# EasyEDA Pro project 数控UPS.epro, board PCB2_1
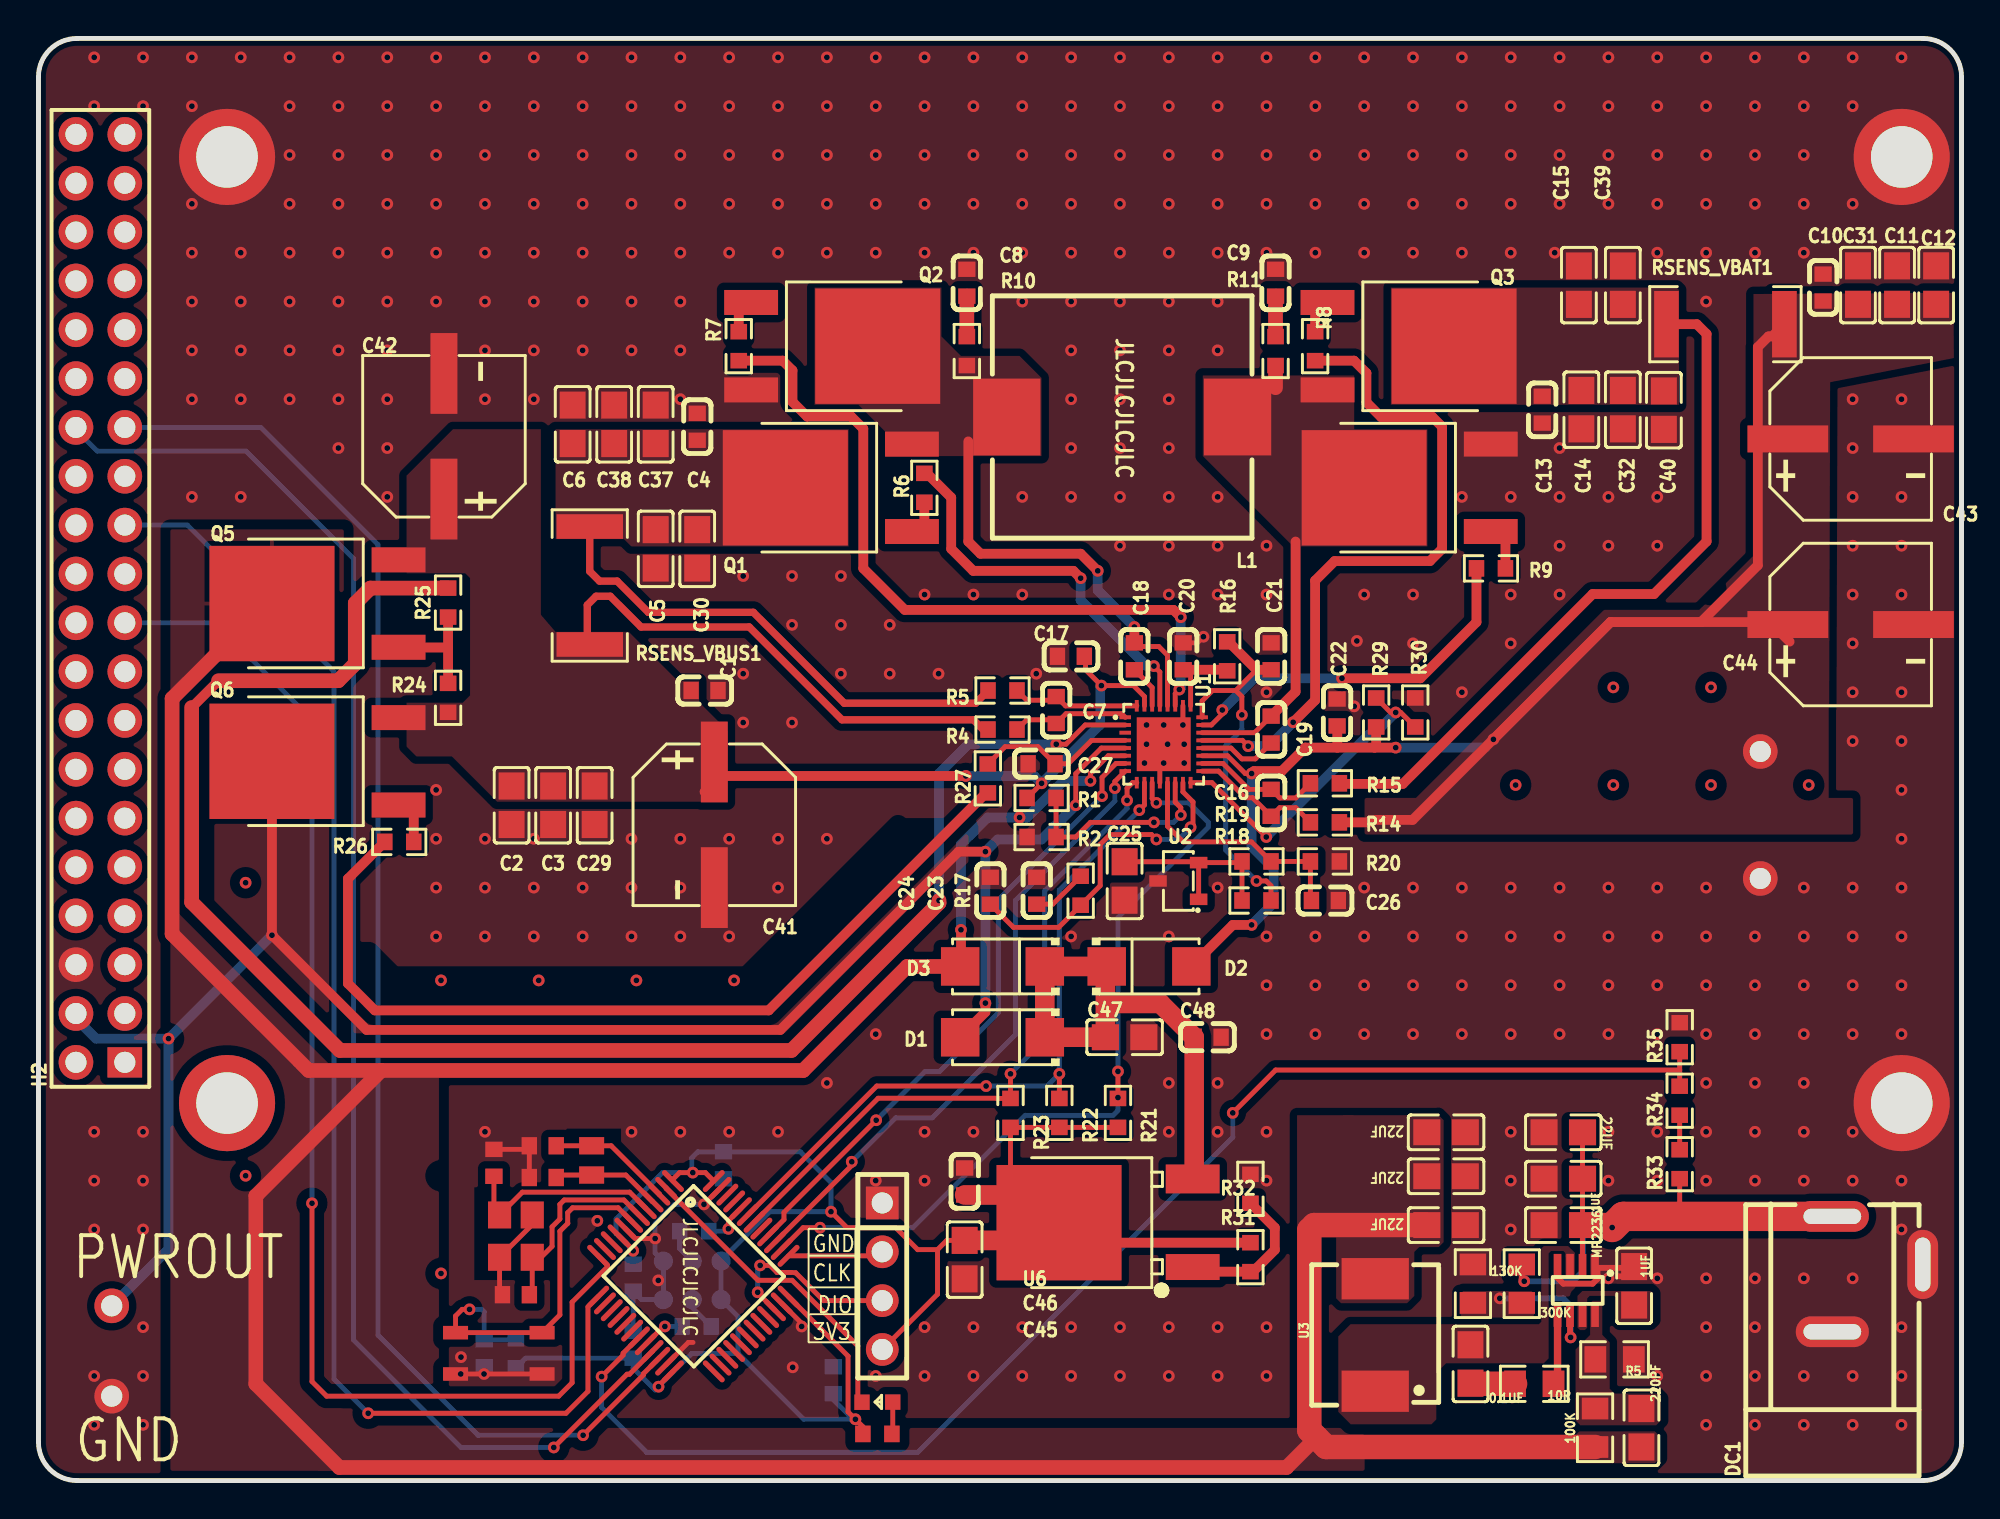
[diagram p7: board, top side]
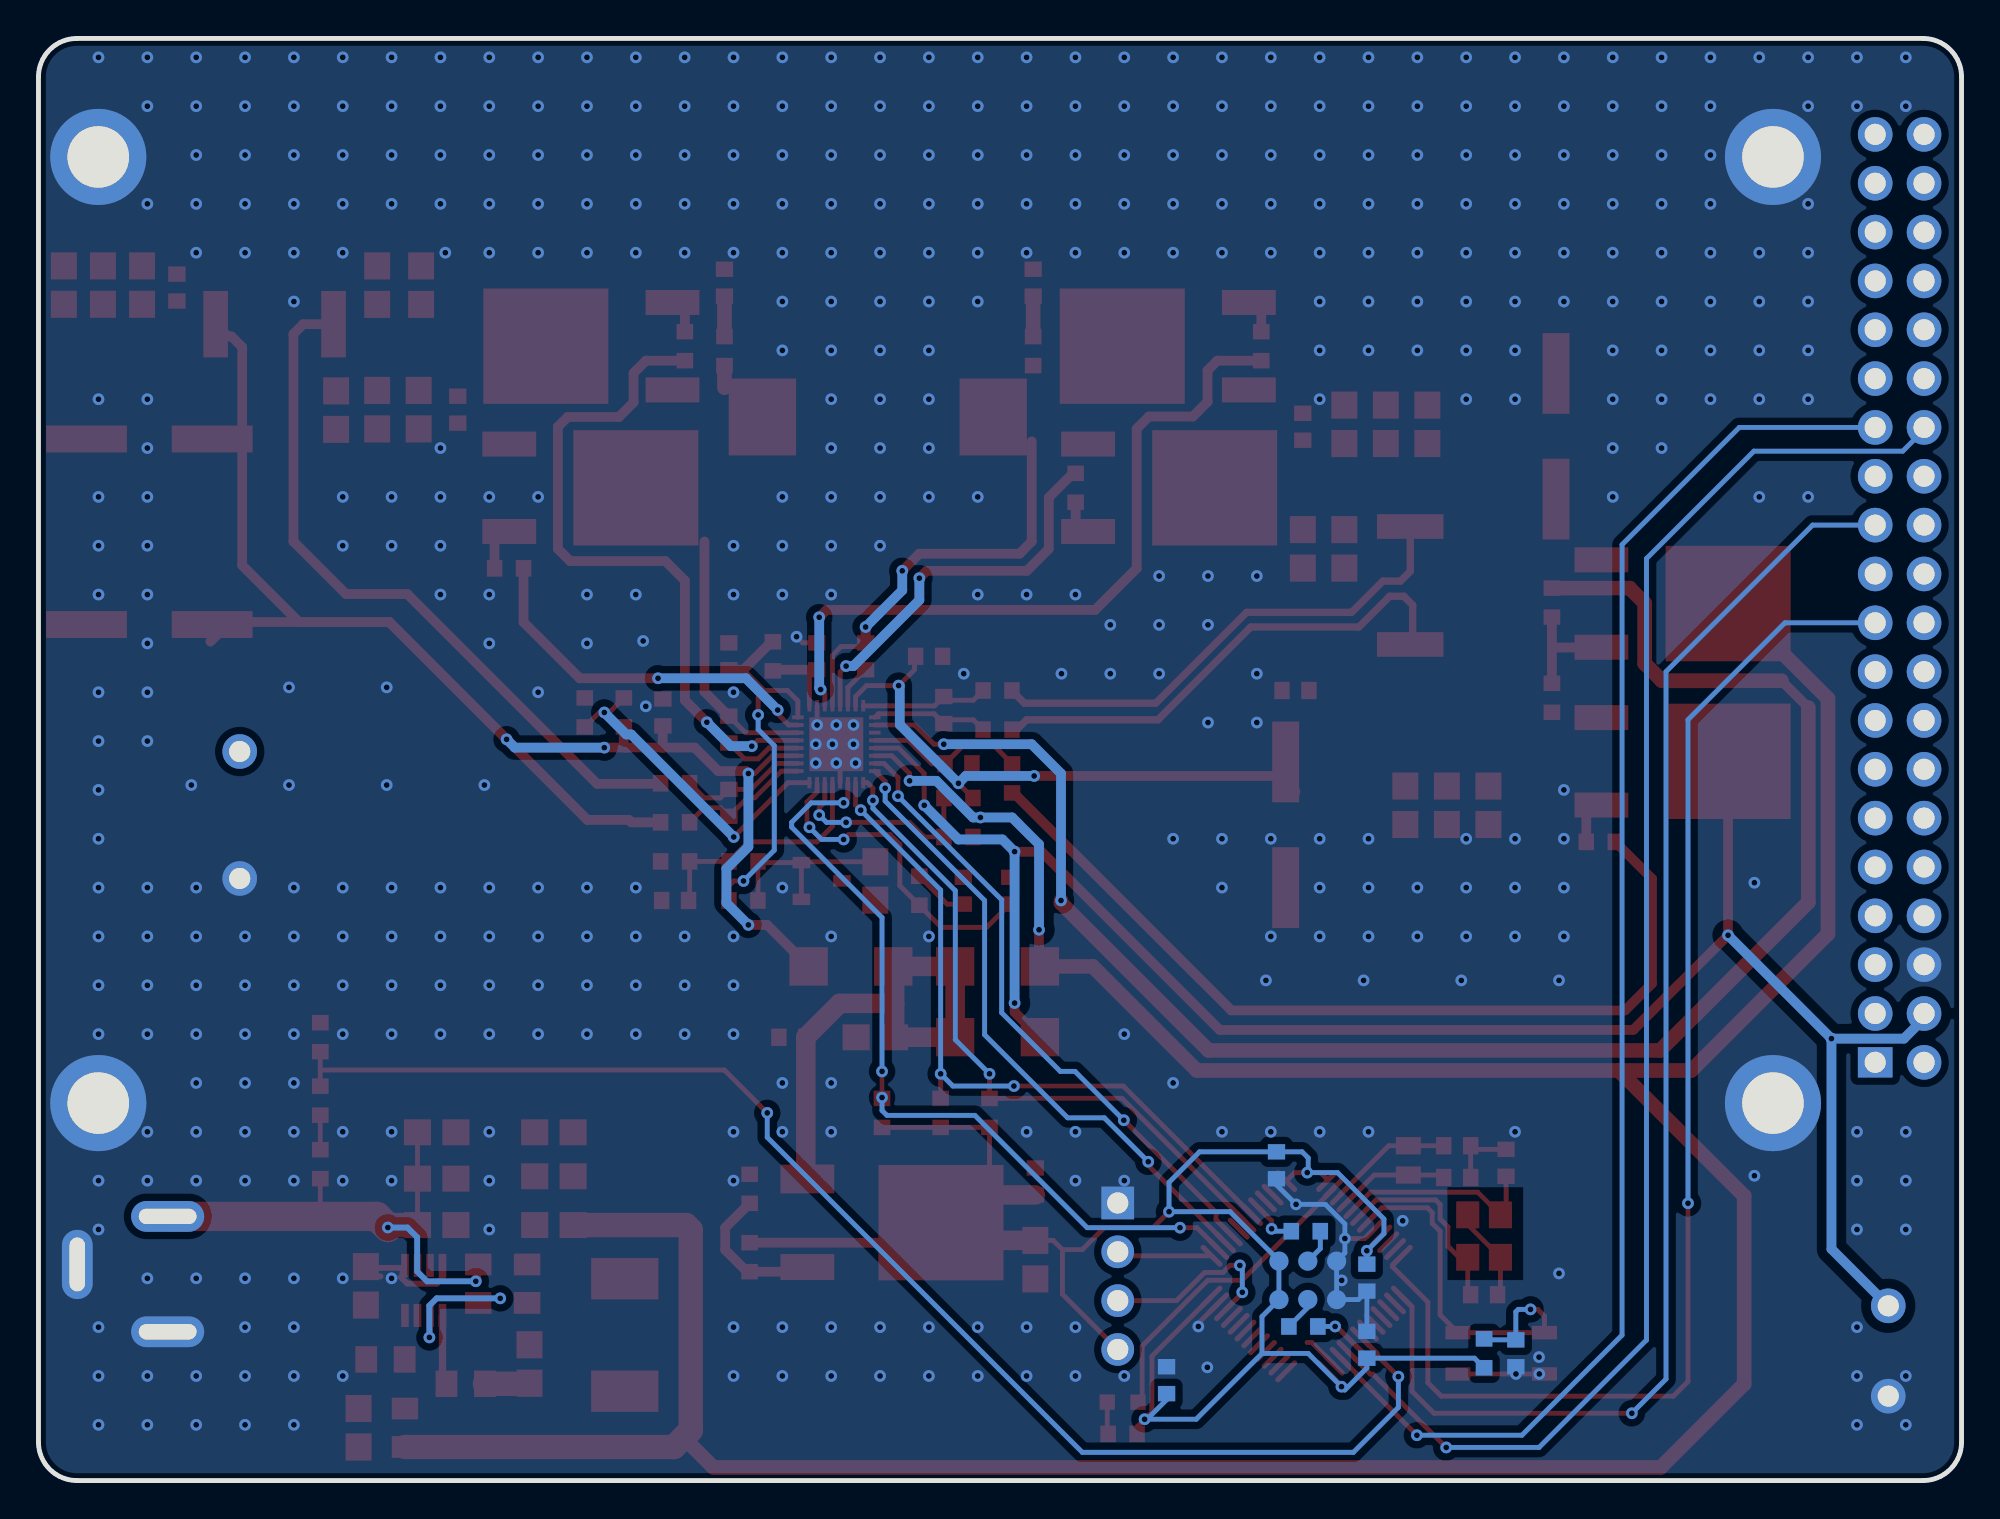
[diagram p8: board, bottom side, seen from below]

Outline 100 x 75 mm; copper layers: Top Layer, Bottom Layer. Coordinates in mm from the lower left corner of the outline.
Outline path: 0,73 0,2 arc(0.59,0.59) 2,0 98,0 arc(99.41,0.59) 100,2 100,73 arc(99.41,74.41) 98,75 2,75 arc(0.59,74.41) 0,73
Stack: Top Layer 0.035mm / Dielectric1 1.51mm FR4 er 4.5 / Bottom Layer 0.035mm

## Design rules (mm)
spacing safeClearance (default): track to track 0.152, other pairs 0.152 to 0.3
track width trackWidth (default): min 0.127, default 0.254, max 2.54
differential pair differentialPair (default): width min 0.127, default 0.254, max 2.54; gap min 0.152, default 0.152
via viaSize (default): diameter min 0.5, default 0.61, max 10; hole min 0.3, default 0.305, max 6
spacing safeClearance (default): track to track 0.152, other pairs 0.152 to 0.3
track width trackWidth (default): min 0.127, default 0.254, max 2.54
differential pair differentialPair (default): width min 0.127, default 0.254, max 2.54; gap min 0.152, default 0.152
via viaSize (default): diameter min 0.5, default 0.61, max 10; hole min 0.3, default 0.305, max 6
spacing safeClearance (default): track to track 0.152, other pairs 0.152 to 0.3
track width trackWidth (default): min 0.127, default 0.254, max 2.54
differential pair differentialPair (default): width min 0.127, default 0.254, max 2.54; gap min 0.152, default 0.152
via viaSize (default): diameter min 0.5, default 0.61, max 10; hole min 0.3, default 0.305, max 6
template: 自定义配置
spacing copperThickness1oz (default): track to track 0.102, other pairs 0.152 to 0.3
spacing copperThickness2oz: track to track 0.203, other pairs 0.152 to 0.3
track width copperThickness1oz: min 0.127, default 0.254, max 2.54
track width copperThickness2oz (default): min 0.203, default 0.254, max 98.999
differential pair differentialPair (default): width min 0.127, default 0.254, max 2.54; gap min 0.152, default 0.152
via viaSize (default): diameter min 0.5, default 0.61, max 10; hole min 0.3, default 0.305, max 6.299
net PWROUT uses copperRegion1
net PWRIN uses copperRegion1
net GND uses PWRGND
pour e4570 uses copperRegion1
pour e4675 uses copperRegion1
pour e5215 uses PWRGND

## Placement (name value [footprint] x y rotation side)
0.1UF  -  [C0805]  74.47 6.06 270 top
1UF  -  [C0805]  82.97 10.13 270 top
1UF#2  -  [C0805]  79.29 13.29 0 top
8M  -  [CRYSTAL-SMD_4P-L3.2-W2.5-BL]  24.83 12.71 270 top
10R  -  [R0805]  77.78 5.03 180 top
100K  -  [R0805]  80.94 2.75 270 top
130K  -  [R0805]  74.59 10.24 270 top
220PF  -  [C0805]  83.35 2.75 270 top
300K  -  [R0805]  77.13 10.24 90 top
C1  100nF  [C0603]  34.64 41.09 180 top
C1#2  -  [C0805]  79.29 18.11 0 top
C2  2.2uF  [C0805]  24.6 35.12 90 top
C2#2  -  [C0805]  79.29 15.7 0 top
C3  10uF  [C0805]  26.76 35.12 90 top
C4  100nF  [C0603]  34.25 54.81 270 top
C5  2.2uF  [C0805]  32.1 48.45 90 top
C5#2  -  [C0603]  30.92 10.55 270 bottom
C6  10uF  [C0805]  27.78 54.93 270 top
C6#2  -  [C0805]  73.19 13.29 180 top
C6#3  -  [C0603]  30.92 7.06 270 bottom
C7  22nF  [C0603]  52.92 40.07 90 top
C7#2  -  [C0805]  73.19 15.83 180 top
C7#3  -  [C0603]  41.34 5.22 90 bottom
C8  1nF  [C0603]  48.28 62.3 90 top
C8#2  -  [C0805]  73.19 18.11 180 top
C8#3  -  [C0603]  35.62 16.4 270 bottom
C9  1nF  [C0603]  64.33 62.3 90 top
C9#2  -  [C0603]  23.18 6.62 90 bottom
C10  100nF  [C0603]  92.8 62.04 270 top
C10#2  -  [C0603]  26.22 17.41 180 top
C11  2.2uF  [C0805]  96.65 62.17 270 top
C11#2  -  [C0603]  26.22 15.76 180 top
C12  10uF  [C0805]  98.68 62.17 270 top
C12#2  -  [C0603]  23.68 16.52 90 top
C13  100nF  [C0603]  78.2 55.69 90 top
C13#2  -  [C0603]  24.83 9.66 0 top
C14  2.2uF  [C0805]  80.23 55.69 90 top
C15  10uF  [C0805]  80.1 62.17 270 top
C16  22nF  [C0603]  64.1 35.25 90 top
C17  1uF  [C0603]  53.69 42.87 180 top
C18  100nF  [C0603]  56.99 42.87 90 top
C19  100nF  [C0603]  64.1 39.06 270 top
C20  1uF  [C0603]  59.53 42.87 90 top
C21  1uF  [C0603]  64.1 42.87 90 top
C22  1uF  [C0603]  67.53 39.95 90 top
C23  22nF  [C0603]  51.91 30.67 270 top
C24  NC  [C0603]  49.5 30.67 270 top
C25  10uF  [C0805]  56.48 31.18 90 top
C26  100nF  [C0603]  66.89 30.17 180 top
C27  NC  [C0603]  52.16 37.28 0 top
C29  10uF  [C0805]  28.92 35.12 90 top
C30  10uF  [C0805]  34.25 48.45 90 top
C31  10uF  [C0805]  94.62 62.17 270 top
C32  10uF  [C0805]  82.39 55.69 90 top
C37  10uF  [C0805]  32.1 54.93 270 top
C38  10uF  [C0805]  29.94 54.93 270 top
C39  10uF  [C0805]  82.39 62.17 270 top
C40  10uF  [C0805]  84.52 55.67 90 top
C41  220uF  [CAP-SMD_BD8.0-L8.3-W8.3-FD]  35.14 34.1 270 top
C42  220uF  [CAP-SMD_BD8.0-L8.3-W8.3-FD]  21.08 54.31 90 top
C43  220uF  [CAP-SMD_BD8.0-L8.3-W8.3-FD]  94.23 54.17 0 top
C44  220uF  [CAP-SMD_BD8.0-L8.3-W8.3-FD]  94.23 44.52 0 top
C45  10uF  [C0805]  48.16 11.49 90 top
C46  100nF  [C0603]  48.16 15.55 270 top
C47  10uF  [C0805]  56.48 23.06 0 top
C48  100nF  [C0603]  60.8 23.06 0 top
D1  SS34  [SMA_L4.3-W2.6-LS5.2-RD]  50.13 23.06 180 top
D2  SS34  [SMA_L4.3-W2.6-LS5.2-RD]  57.75 26.74 0 top
D3  SS34  [SMA_L4.3-W2.6-LS5.2-RD]  50.13 26.74 180 top
DC1  DC-005-5.5*2.1  [DC-IN-TH_DC-005-2]  95.63 10.74 90 top
H1  -  [HDR-TH_4P-P2.54-V-M]  43.88 10.63 270 top
H2  B-2100S40P-B110  [HDR-TH_40P-P2.54-V-M-R2-C20-S2.54]  3.22 45.88 90 top
L1  3.3uH  [IND-SMD_L13.5-W12.6]  56.35 55.31 0 top
LED2  -  [LED0603-RD]  43.62 4.08 0 top
MP2236  -  [MP2236]  80.94 8.59 180 top
NOREF  -  [Pad_e7509]  3.81 4.39 0 top
NOREF#2  -  [Pad_e152]  9.81 19.63 0 top
NOREF#3  -  [Pad_e4203]  3.81 9.09 0 top
NOREF#4  -  [Pad_e7513]  89.53 37.92 0 top
NOREF#5  -  [Pad_e150]  96.89 19.63 0 top
NOREF#6  -  [Pad_e148]  96.89 68.84 0 top
NOREF#7  -  [Pad_e7515]  89.53 31.31 0 top
NOREF#8  -  [Pad_e155]  9.81 68.84 0 top
Q1  NCE4060K  [TO-252-2_L6.6-W6.1-P4.57-LS9.9-TL-CW]  42.13 51.63 180 top
Q2  NCE4060K  [TO-252-2_L6.6-W6.1-P4.57-LS9.9-TL-CW]  40.35 59 0 top
Q3  NCE4060K  [TO-252-2_L6.6-W6.1-P4.57-LS9.9-TL-CW]  70.32 59 0 top
Q4  NCE4060K  [TO-252-2_L6.6-W6.1-P4.57-LS9.9-TL-CW]  72.23 51.63 180 top
Q5  NCE60P50K  [TO-252-2_L6.6-W6.1-P4.57-LS9.9-TL-CW]  15.43 45.61 180 top
Q6  NCE60P50K  [TO-252-2_L6.6-W6.1-P4.57-LS9.9-TL-CW]  15.43 37.41 180 top
R1  10K  [R0603]  52.16 35.5 180 top
R2  10K  [R0603]  52.16 33.47 0 top
R2#2  -  [R0603]  34.23 8.01 0 bottom
R3  10R  [R0603]  34.1 12.97 0 bottom
R4  2Ω  [R0603]  50.13 39.06 180 top
R4#2  -  [R0603]  24.83 6.62 270 bottom
R5  2Ω  [R0805]  81.96 6.3 180 top
R5#2  -  [R0603]  50.13 41.09 180 top
R5#3  -  [R0603]  43.62 2.43 0 top
R6  1Ω  [R0603]  46.07 51.63 270 top
R7  1Ω  [R0603]  36.41 59 90 top
R8  1Ω  [R0603]  66.39 59 270 top
R9  1Ω  [R0603]  75.53 47.44 180 top
R10  2.2Ω  [R0603]  48.28 58.74 90 top
R11  2.2Ω  [R0603]  64.33 58.74 90 top
R14  2Ω  [R0603]  66.89 34.23 0 top
R15  2Ω  [R0603]  66.89 36.26 0 top
R16  0Ω  [R0603]  61.81 42.87 90 top
R17  10k  [R0603]  54.19 30.67 270 top
R18  1k  [R0603]  63.34 30.17 0 top
R19  10K  [R0603]  63.34 32.2 180 top
R20  10K  [R0603]  66.89 32.2 180 top
R21  10k  [R0603]  56.13 19.12 90 top
R22  4.7kΩ  [R0603]  53.09 19.12 90 top
R23  4.7kΩ  [R0603]  50.55 19.12 90 top
R24  10K  [R0603]  21.3 40.71 270 top
R25  0Ω  [R0603]  21.3 45.66 270 top
R26  0Ω  [R0603]  18.76 33.22 0 top
R27  0Ω  [R0603]  49.37 36.52 90 top
R29  0Ω  [R0603]  69.56 39.95 270 top
R30  NC  [R0603]  71.59 39.95 270 top
R31  200Ω  [R0603]  63.02 11.62 270 top
R32  330Ω  [R0603]  63.02 15.17 90 top
R33  300K  [R0603]  85.34 16.45 90 top
R34  130K  [R0603]  85.34 19.75 90 top
R35  100K  [R0603]  85.34 23.06 90 top
RSENS_VBAT1  10mΩ  [R2512]  87.72 60.14 0 top
RSENS_VBUS1  10mΩ  [R2512]  28.67 46.55 90 top
STM32F103C8T6  -  [LQFP-48_L7.0-W7.0-P0.50-LS9.0-BL]  34.05 10.63 225 top
SW1  -  [SW-SMD_4P-L4.2-W3.3-P2.15-LS5.1]  23.94 6.62 0 top
U1  SC8815QDER  [QFN-32_L4.0-W4.0-P0.40-BL-EP2.7]  58.51 38.3 270 top
U1#2  -  [焊点3*2]  35.5 9.41 90 bottom
U2  TL431  [SOT-23-3_L2.9-W1.4-P1.90-LS2.6-BR]  59.27 31.18 0 top
U3  3.3uh  [IND-SMD_L6.8-W6.8_SMMS0630]  69.51 7.57 90 top
U6  LM317AG-TN3-R  [TO-252-2_L6.5-W6.1-P4.58-LS10.0-TL]  56.54 13.39 180 top
X1  -  [CRYSTAL-SMD_L2.0-W1.2]  28.76 16.65 90 top

## Footprints (pads in the part's own frame, mm; a bottom-side part is the same pattern mirrored in y, then rotated)
C0603
  rect 0.8x0.9 smd: 1(-0.7,0) 2(0.7,0)
C0805
  rect 1.41x1.35 smd: 1(-1,0) 2(1,0)
CAP-SMD_BD8.0-L8.3-W8.3-FD
  rect 4.2x1.4 smd: 1(-3.267,0) 2(3.267,0)
CRYSTAL-SMD_4P-L3.2-W2.5-BL
  rect 1.4x1.2 smd: 1(-1.1,-0.85) 2(1.1,-0.85) 3(1.1,0.85) 4(-1.1,0.85)
CRYSTAL-SMD_L2.0-W1.2
  rect 0.899x1.3 smd: 1(-0.762,0) 2(0.762,0)
DC-IN-TH_DC-005-2
  oval 1.6x3.8 hole 0.8x3: 1(2.999,2.35) 2(-3,2.35)
  oval 3.6x1.6 hole 2.8x0.8: 3(0.5,-2.35)
HDR-TH_4P-P2.54-V-M
  rect 1.7x1.7 hole 1.1: 1(-3.81,0)
  round 1.7 hole 1.1: 2(-1.27,0) 3(1.27,0) 4(3.81,0)
HDR-TH_40P-P2.54-V-M-R2-C20-S2.54
  rect 1.575x1.8 hole 1.1: 1(-24.13,-1.27)
  round 1.8 hole 1.1: 2(-24.13,1.27) 3(-21.59,-1.27) 4(-21.59,1.27) 5(-19.05,-1.27) 6(-19.05,1.27) 7(-16.51,-1.27) 8(-16.51,1.27) 9(-13.97,-1.27) 10(-13.97,1.27) 11(-11.43,-1.27) 12(-11.43,1.27) 13(-8.89,-1.27) 14(-8.89,1.27) 15(-6.35,-1.27) 16(-6.35,1.27) 17(-3.81,-1.27) 18(-3.81,1.27) 19(-1.27,-1.27) 20(-1.27,1.27) 21(1.27,-1.27) 22(1.27,1.27) 23(3.81,-1.27) 24(3.81,1.27) 25(6.35,-1.27) 26(6.35,1.27) 27(8.89,-1.27) 28(8.89,1.27) 29(11.43,-1.27) 30(11.43,1.27) 31(13.97,-1.27) 32(13.97,1.27) 33(16.51,-1.27) 34(16.51,1.27) 35(19.05,-1.27) 36(19.05,1.27) 37(21.59,-1.27) 38(21.59,1.27) 39(24.13,-1.27) 40(24.13,1.27)
IND-SMD_L6.8-W6.8_SMMS0630
  rect 2.15x3.5 smd: 1(-2.925,0) 2(2.925,0)
IND-SMD_L13.5-W12.6
  rect 3.5x4 smd: 1(-6,0) 2(6,0)
LED0603-RD
  rect 0.8x0.8 smd: 1(-0.799,-0.004) 2(0.799,0.004)
LQFP-48_L7.0-W7.0-P0.50-LS9.0-BL
  oval 0.27x1.5 smd: 1(-2.75,-4.25) 2(-2.25,-4.25) 3(-1.75,-4.25) 4(-1.25,-4.25) 5(-0.75,-4.25) 6(-0.25,-4.25) 7(0.25,-4.25) 8(0.75,-4.25) 9(1.25,-4.25) 10(1.75,-4.25) 11(2.25,-4.25) 12(2.75,-4.25) 25(2.75,4.25) 26(2.25,4.25) 27(1.75,4.25) 28(1.25,4.25) 29(0.75,4.25) 30(0.25,4.25) 31(-0.25,4.25) 32(-0.75,4.25) 33(-1.25,4.25) 34(-1.75,4.25) 35(-2.25,4.25) 36(-2.75,4.25)
  oval 1.5x0.27 smd: 13(4.25,-2.75) 14(4.25,-2.25) 15(4.25,-1.75) 16(4.25,-1.25) 17(4.25,-0.75) 18(4.25,-0.25) 19(4.25,0.25) 20(4.25,0.75) 21(4.25,1.25) 22(4.25,1.75) 23(4.25,2.25) 24(4.25,2.75) 37(-4.25,2.75) 38(-4.25,2.25) 39(-4.25,1.75) 40(-4.25,1.25) 41(-4.25,0.75) 42(-4.25,0.25) 43(-4.25,-0.25) 44(-4.25,-0.75) 45(-4.25,-1.25) 46(-4.25,-1.75) 47(-4.25,-2.25) 48(-4.25,-2.75)
MP2236
  rect 0.4x1.2 smd: 1(0,-2.6) 2(0.65,-2.6) 3(1.3,-2.6) 4(1.95,-2.6) 5(1.95,0) 6(1.3,0) 7(0.65,0) 8(0,0)
Pad_e148
  round 5 hole 3.2: 1(0,0)
Pad_e150
  round 5 hole 3.2: 1(0,0)
Pad_e152
  round 5 hole 3.2: 1(0,0)
Pad_e155
  round 5 hole 3.2: 1(0,0)
Pad_e4203
  round 1.8 hole 1.1: 1(0,0)
Pad_e7509
  round 1.8 hole 1.1: 1(0,0)
Pad_e7513
  round 1.8 hole 1.1: 1(0,0)
Pad_e7515
  round 1.8 hole 1.1: 1(0,0)
QFN-32_L4.0-W4.0-P0.40-BL-EP2.7
  rect 0.2x0.6 smd: 1(-1.4,-2) 2(-1,-2) 3(-0.6,-2) 4(-0.2,-2) 5(0.2,-2) 6(0.6,-2) 7(1,-2) 8(1.4,-2) 17(1.4,2) 18(1,2) 19(0.6,2) 20(0.2,2) 21(-0.2,2) 22(-0.6,2) 23(-1,2) 24(-1.4,2)
  rect 0.6x0.2 smd: 9(2,-1.4) 10(2,-1) 11(2,-0.6) 12(2,-0.2) 13(2,0.2) 14(2,0.6) 15(2,1) 16(2,1.4) 25(-2,1.4) 26(-2,1) 27(-2,0.6) 28(-2,0.2) 29(-2,-0.2) 30(-2,-0.6) 31(-2,-1) 32(-2,-1.4)
  rect 2.8x2.8 smd: 33(0,0)
R0603
  rect 0.806x0.864 smd: 1(-0.753,0) 2(0.753,0)
R0805
  rect 1.133x1.377 smd: 1(-1,0) 2(1,0)
R2512
  rect 1.282x3.456 smd: 1(-3.067,0) 2(3.067,0)
SMA_L4.3-W2.6-LS5.2-RD
  rect 2x2 smd: 1(-2.2,0) 2(2.2,0)
SOT-23-3_L2.9-W1.4-P1.90-LS2.6-BR
  rect 0.91x0.6 smd: 1(1.055,-0.955) 2(1.055,0.955) 3(-1.055,0)
SW-SMD_4P-L4.2-W3.3-P2.15-LS5.1
  rect 1.3x0.701 smd: 1(-2.251,1.075) 2(2.251,1.075) 3(-2.251,-1.075) 4(2.251,-1.075)
TO-252-2_L6.5-W6.1-P4.58-LS10.0-TL
  rect 2.8x1.35 smd: 1(-3.475,2.29)
  rect 2.8x1.5 smd: 3(-3.475,-2.29)
  rect 6.5x6 smd: 4(3.475,-0.017)
TO-252-2_L6.6-W6.1-P4.57-LS9.9-TL-CW
  rect 2.8x1.3 smd: 1(-3.292,2.273) 3(-3.292,-2.273)
  rect 6.5x6 smd: 2(3.292,0)
焊点3*2
  round 1 smd: 1(0,0) 2(0,-1.5) 3(0,-3) 4(2,-3) 5(2,-1.5) 6(2,0)

## Nets
3V3: C5#2.1 C6#3.2 C7#3.1 C8#3.1 C45.2 C46.2 H1.4 R4#2.2 R5#3.1 R21.1 R22.1 R23.1 R31.1 STM32F103C8T6.1 STM32F103C8T6.9 STM32F103C8T6.24 STM32F103C8T6.36 STM32F103C8T6.48 U1#2.1 U1#2.6 U6.4
12V: 1UF#2.2 300K.2 C1#2.2 C2#2.2 DC1.1 MP2236.2 R33.1
+5V_IC: C21.1 R16.2 R18.2 U1.24
GND: 1UF.1 1UF#2.1 8M.2 8M.4 130K.1 C1.1 C1#2.1 C2.1 C2#2.1 C3.1 C4.1 C5.1 C5#2.2 C6.1 C6#2.1 C6#3.1 C7#2.1 C7#3.2 C8.2 C8#2.1 C8#3.2 C9.2 C9#2.1 C10.1 C10#2.2 C11.1 C11#2.2 C12.1 C12#2.2 C13.1 C13#2.1 C14.1 C15.1 C17.2 C20.2 C21.2 C22.2 C23.1 C24.1 C25.1 C26.1 C27.1 C29.1 C30.1 C31.1 C32.1 C37.1 C38.1 C39.1 C40.1 C41.2 C42.2 C43.2 C44.2 C45.1 C46.1 C47.2 C48.2 DC1.2 DC1.3 H1.1 H2.6 MP2236.1 MP2236.4 NOREF.1 NOREF#2.1 NOREF#5.1 NOREF#6.1 NOREF#7.1 NOREF#8.1 Q2.3 Q4.3 R2.1 R5.1 R20.1 R30.1 R32.2 R35.2 STM32F103C8T6.8 STM32F103C8T6.23 STM32F103C8T6.35 STM32F103C8T6.47 SW1.3 SW1.4 U1.12 U1.26 U1.33 U1#2.3 U1#2.4 U2.3
VBAT: C10.2 C11.2 C12.2 C22.1 C31.2 C43.1 C44.1 D2.2 NOREF#4.1 R14.2 R29.2 RSENS_VBAT1.2 U1.19
VBATS: R29.1 R30.2 U1.16
VBUS: C1.2 C2.2 C3.2 C17.1 C29.2 C41.1 C42.1 Q5.3 Q6.3 R1.2 R4.2 R24.2 RSENS_VBUS1.1 U1.31
#CE: STM32F103C8T6.40 U1.7
ADC: R34.2 R35.1 STM32F103C8T6.19
ADIN: C26.2 R19.1 R20.2 U1.13
BOOT0: R3.2 STM32F103C8T6.44
BOOT1: R2#2.1 STM32F103C8T6.20
BT1: C18.1 U1.30
BT2: C19.2 U1.20
FB: R1.1 R2.2 U1.14
GPO: R25.1 U1.2
HD1: R6.1 U1.29
HD2: R8.2 U1.21
INT: R21.2 STM32F103C8T6.38 U1.11
LD1: R7.1 U1.27
LD2: R9.2 U1.23
NRST: C9#2.2 R4#2.1 STM32F103C8T6.7 SW1.1 SW1.2
OSC32_IN: C10#2.1 STM32F103C8T6.3 X1.2
OSC32_OUT: C11#2.1 STM32F103C8T6.4 X1.1
OSC_IN: 8M.1 C12#2.1 STM32F103C8T6.5
OSC_OUT: 8M.3 C13#2.2 STM32F103C8T6.6
PA0: STM32F103C8T6.10
PA1: STM32F103C8T6.11
PA4: STM32F103C8T6.14
PA5: STM32F103C8T6.15
PA6: STM32F103C8T6.16
PA7: STM32F103C8T6.17
PA8: STM32F103C8T6.29
PA9: STM32F103C8T6.30
PA10: STM32F103C8T6.31
PA11: STM32F103C8T6.32
PA12: STM32F103C8T6.33
PB0: STM32F103C8T6.18
PB5: STM32F103C8T6.41
PB8: STM32F103C8T6.45
PB9: STM32F103C8T6.46
PB12: STM32F103C8T6.25
PB13: STM32F103C8T6.26
PB14: STM32F103C8T6.27
PB15: STM32F103C8T6.28
PC13: LED2.1 STM32F103C8T6.2
PGATE: R26.1 R27.1
PSTOP: STM32F103C8T6.39 U1.8
PWRIN: 100K.2 220PF.2 C6#2.2 C7#2.2 C8#2.2 D3.2 Q5.2 U1.6 U3.2
PWROUT: D1.2 H2.4 NOREF#3.1 Q6.2 U1.5
RX: H2.23 STM32F103C8T6.13
SCL: R23.2 STM32F103C8T6.42 U1.9
SCL2: H2.28 STM32F103C8T6.21
SDA: R22.2 STM32F103C8T6.43 U1.10
SDA2: H2.27 STM32F103C8T6.22
SNS1N: C7.2 R5#2.1 U1.32
SNS1P: C7.1 R4.1 U1.1
SNS2N: C16.1 R14.1 U1.17
SNS2P: C16.2 R15.1 U1.18
SW1: C18.2 L1.1 Q1.3 Q2.2 R10.1 U1.28
SW2: C19.1 L1.2 Q3.3 Q4.2 R11.1 U1.22
SWCLK: H1.2 STM32F103C8T6.37
SWDIO: H1.3 STM32F103C8T6.34
TX: H2.19 STM32F103C8T6.12
$1N171: 130K.2 300K.1 MP2236.6
$1N800: 1UF.2 MP2236.7
$1N1061: 10R.1 MP2236.5
$1N1238: 0.1UF.2 10R.2
$1N1269: 0.1UF.1 MP2236.3 U3.1
$1N1940: 100K.1 220PF.1 MP2236.8 R5.2
$1N4997: LED2.2 R5#3.2
$1N5550: Q1.1 R6.2
$1N5553: Q2.1 R7.2
$1N5556: Q3.1 R8.1
$1N5559: Q4.1 R9.1
$1N5746: C8.1 R10.2
$1N5749: C9.1 R11.2
$1N7696: C20.1 R16.1 U1.25
$1N8787: R2#2.2 U1#2.2
$1N8790: R3.1 U1#2.5
$1N8909: C23.2 R17.1
$1N8945: C24.2 R17.2 U1.15
$1N10523: C25.2 R18.1 R19.2 U2.1 U2.2
$1N10819: C27.2 R27.2 U1.4
$1N11094: Q5.1 R24.1 R25.2
$1N11328: Q6.1 R26.2
$1N29448: C4.2 C5.2 C6.2 C30.2 C37.2 C38.2 Q1.2 R5#2.2 RSENS_VBUS1.2
$1N29969: C13.2 C14.2 C15.2 C32.2 C39.2 C40.2 Q3.2 R15.2 RSENS_VBAT1.1
$1N46207: R31.2 R32.1 U6.1
$1N53072: C47.1 C48.1 D1.1 D2.1 D3.1 U6.3

Pads without a net: H2 1 2 3 5 7 8 9 10 11 12 13 14 15 16 17 18 20 21 22 24 25 26 29 30 31 32 33 34 35 36 37 38 39 40; R33 2; R34 1; U1 3

## Via types
v1: diameter 0.61, hole 0.305, Top Layer to Bottom Layer, 549 vias
v2: diameter 0.6, hole 0.305, Top Layer to Bottom Layer, 1 via

## Routing (per net, layer and track width the routed paths; a pad name or vN(x,y) marks a point on that pad's centre or on a via; arc(x,y) is an arc through that point)
3V3: length 111.4
  Top Layer w0.254: STM32F103C8T6.9 30.92,11.99 v1(30.92,11.95) ; 51.63,14.85 50.55,15.93 R23.1 R22.1 R21.1 ; R5#3.1 42.87,2.8 v1(42.48,3.19) 42.1,3.57 42.1,6.47 STM32F103C8T6.36 ; STM32F103C8T6.1 32.99,15.67 33.34,16.01 v1(34.03,16.01) 34.68,16.01 STM32F103C8T6.48 ; v1(32.24,4.88) 32.24,4.93 32.99,5.68 ; C45.2 47.23,12.49 46.75,12.01 ; 46.75,12.01 46.75,9.69 H1.4 ; 46.75,12.01 45.72,12.01 44.58,13.15 42.04,13.15 v1(41.21,13.98)
  Top Layer w0.508: R31.1 54.11,12.37 53.07,13.41
  Top Layer w1.016: C45.2 52.15,12.49 53.07,13.41 51.63,14.85 C46.2
  Bottom Layer w0.254: 42.35,3.19 39.8,3.19 36.38,6.61 ; 42.35,3.19 41.34,4.2 C7#3.1 ; 42.35,3.19 v1(42.48,3.19) ; 36.38,6.61 33.97,6.61 32.07,4.71 30.92,5.85 C6#3.2 25.33,6.36 R4#2.2 ; 36.38,6.61 36.38,8.53 U1#2.1 U1#2.6 35.5,11.44 38.04,13.98 v1(41.21,13.98) 41.21,15.51 39.62,17.1 C8#3.1 34.29,17.1 33.97,16.78 33.97,16.07 v1(34.03,16.01) 32.45,16.01 30.03,13.6 30.03,12.84 v1(30.92,11.95) C5#2.1
12V: length 29.9
  Top Layer w0.254: 85.3,13.74 85.34,13.78 R33.1 ; C1#2.2 C2#2.2 1UF#2.2 ; 80.29,11.19 80.29,13.28
  Top Layer w0.305: 300K.2 77.13,10.49 v1(77.26,10.37)
  Top Layer w1.27: 1UF#2.2 81.7,13.29 v1(81.83,13.16)
  Top Layer w1.524: v1(81.83,13.16) 82.41,13.74 DC1.1
  Bottom Layer w0.305: v1(81.83,13.16) 80.81,13.16 80.31,12.65 80.31,10.87 79.8,10.37 v1(77.26,10.37)
+5V_IC: length 19.9
  Top Layer w0.254: U1.24 60.51,40.55 61.05,41.09 62.26,41.09 ; v1(62.58,39.82) 62.58,40.77 62.26,41.09 ; 62.26,41.09 63.34,42.17 ; R18.2 64.09,30.94 63.85,31.18 v1(63.34,31.18)
  Top Layer w0.508: C21.1 63.34,42.17 61.88,43.62 R16.2
  Bottom Layer w0.254: v1(63.34,31.18) 61.74,32.78 61.74,38.22 62.58,39.06 v1(62.58,39.82)
GND: length 44.3
  Top Layer w0.254: C20.2 60.26,43.57 v1(60.58,43.89) ; STM32F103C8T6.47 34.61,14.36 v1(34.61,14.36) ; C13#2.1 23.98,9.81 8M.2 25.68,13.31 8M.4 ; 32.64,6.03 33.79,7.18 34.04,7.18 ; SW1.3 v1(23.17,5.54) SW1.4 ; STM32F103C8T6.8 31.03,12.59 v1(32.07,12.59) ; C12#2.2 25.34,17.22 C10#2.2 C11#2.2 ; STM32F103C8T6.35 39.69,8.18 v1(39.69,8.01) ; U1.12 58.31,38.09 U1.33 v1(59.51,39.3) U1.26
  Top Layer w0.305: 1UF.1 82.91,11.06 ; 82.91,11.06 81.07,11.06 81.07,10.49 ; 82.91,11.06 82.47,10.62 82.21,10.62 ; 81.07,10.49 80.81,10.24 79.29,10.24 78.99,10.54 78.99,11.19 ; 81.07,10.49 81.16,10.59
  Bottom Layer w0.254: 30.92,7.76 C5#2.2 31.37,9.41 U1#2.3 U1#2.4 32.07,11.84 v1(32.07,12.59) 32.07,13.35 33.08,14.36 v1(34.61,14.36) 35.62,15.38 C8#3.2
  vias: v1(2.9,74.02) v1(2.9,71.48) v1(2.9,18.14) v1(2.9,15.6) v1(2.9,13.06) v1(2.9,5.44) v1(2.9,2.9) v1(5.44,74.02) v1(5.44,71.48) v1(5.44,18.14) v1(5.44,15.6) v1(5.44,13.06) v1(5.44,7.98) v1(5.44,5.44) v1(5.44,2.9) v1(7.98,74.02) v1(7.98,71.48) v1(7.98,66.4) v1(7.98,63.86) v1(7.98,61.32) v1(7.98,58.78) v1(7.98,56.24) v1(7.98,51.16) v1(10.52,74.02) v1(10.52,63.86) v1(10.52,61.32) v1(10.52,58.78) v1(10.52,56.24) v1(10.52,51.16) v1(10.77,31.09) v1(10.77,15.85) v1(13.06,74.02) v1(13.06,71.48) v1(13.06,68.94) v1(13.06,66.4) v1(13.06,63.86) v1(13.06,61.32) v1(13.06,58.78) v1(13.06,56.24) v1(15.6,74.02) v1(15.6,71.48) v1(15.6,68.94) v1(15.6,66.4) v1(15.6,63.86) v1(15.6,61.32) v1(15.6,58.78) v1(15.6,56.24) v1(15.6,53.7) v1(18.14,74.02) v1(18.14,71.48) v1(18.14,68.94) v1(18.14,66.4) v1(18.14,63.86) v1(18.14,61.32) v1(18.14,58.78) v1(18.14,56.24) v1(18.14,53.7) v1(18.14,51.16) v1(20.68,74.02) v1(20.68,71.48) v1(20.68,68.94) v1(20.68,66.4) v1(20.68,63.86) v1(20.68,61.32) v1(20.68,35.92) v1(20.68,33.38) v1(20.68,30.84) v1(20.68,28.3) v1(20.93,26.01) v1(20.93,10.77) v1(21.97,6.42) v1(21.96,5.54) v1(23.22,74.02) v1(23.22,71.48) v1(23.22,68.94) v1(23.22,66.4) v1(23.22,63.86) v1(23.22,61.32) v1(23.22,58.78) v1(23.22,56.24) v1(23.22,33.38) v1(23.22,30.84) v1(23.22,28.3) v1(23.22,18.14) v1(25.76,74.02) v1(25.76,71.48) v1(25.76,68.94) v1(25.76,66.4) v1(25.76,63.86) v1(25.76,61.32) v1(25.76,58.78) v1(25.76,56.24) v1(25.76,33.38) v1(25.76,30.84) v1(25.76,28.3) v1(26.01,26.01) v1(28.3,74.02) v1(28.3,71.48) v1(28.3,68.94) v1(28.3,66.4) v1(28.3,63.86) v1(28.3,61.32) v1(28.3,58.78) v1(28.3,30.84) v1(28.3,28.3) v1(29.06,13.51) v1(30.84,74.02) v1(30.84,71.48) v1(30.84,68.94) v1(30.84,66.4) v1(30.84,63.86) v1(30.84,61.32) v1(30.84,58.78) v1(30.84,33.38) v1(30.84,30.84) v1(30.84,28.3) v1(30.84,18.14) v1(31.09,26.01) v1(32.23,10.41) v1(33.38,74.02) v1(33.38,71.48) v1(33.38,68.94) v1(33.38,66.4) v1(33.38,63.86) v1(33.38,61.32) v1(33.38,58.78) v1(33.38,56.24) v1(33.38,33.38) v1(33.38,30.84) v1(33.38,28.3) v1(33.38,18.14) v1(35.92,74.02) v1(35.92,71.48) v1(35.92,68.94) v1(35.92,66.4) v1(35.92,63.86) v1(35.92,33.38) v1(35.92,28.3) v1(35.92,18.14) v1(36.17,26.01) v1(36.65,47.04) v1(36.65,41.96) v1(36.65,39.42) v1(38.46,74.02) v1(38.46,71.48) v1(38.46,68.94) v1(38.46,66.4) v1(38.46,63.86) v1(38.46,33.38) v1(38.46,30.84) v1(38.46,18.14) v1(39.19,47.04) v1(39.19,44.5) v1(39.19,39.42) v1(39.22,5.89) v1(41,74.02) v1(41,71.48) v1(41,68.94) v1(41,66.4) v1(41,63.86) v1(41,33.38) v1(41,20.68) v1(41.72,47.04) v1(41.72,44.5) v1(41.72,41.96) v1(43.54,74.02) v1(43.54,71.48) v1(43.54,68.94) v1(43.54,66.4) v1(43.54,63.86) v1(43.54,23.22) v1(43.54,15.6) v1(43.54,5.44) v1(44.26,44.5) v1(44.26,41.96) v1(46.08,74.02) v1(46.08,71.48) v1(46.08,68.94) v1(46.08,66.4) v1(46.08,63.86) v1(46.08,46.08) v1(46.08,18.14) v1(46.08,15.6) v1(46.08,7.98) v1(46.08,5.44) v1(46.81,41.96) v1(48.62,74.02) v1(48.62,71.48) v1(48.62,68.94) v1(48.62,66.4) v1(48.62,63.86) v1(48.62,46.08) v1(48.62,18.14) v1(48.62,7.98) v1(48.62,5.44) v1(51.16,74.02) v1(51.16,71.48) v1(51.16,68.94) v1(51.16,66.4) v1(51.16,63.86) v1(51.16,61.32) v1(51.16,51.16) v1(51.16,46.08) v1(51.16,7.98) v1(51.16,5.44) v1(51.88,41.96) v1(53.7,74.02) v1(53.7,71.48) v1(53.7,68.94) v1(53.7,66.4) v1(53.7,63.86) v1(53.7,61.32) v1(53.7,58.78) v1(53.7,56.24) v1(53.7,53.7) v1(53.7,51.16) v1(53.7,28.3) v1(53.7,7.98) v1(53.7,5.44) v1(56.24,74.02) v1(56.24,71.48) v1(56.24,68.94) v1(56.24,66.4) v1(56.24,63.86) v1(56.24,61.32) v1(56.24,58.78) v1(56.24,56.24) v1(56.24,53.7) v1(56.24,51.16) v1(56.24,48.62) v1(56.24,7.98) v1(56.24,5.44) v1(57.51,37.31) v1(57.62,39.3) v1(57.62,38.3) v1(58.51,39.3) v1(58.51,37.31) v1(58.72,38.3) v1(58.78,74.02) v1(58.78,71.48) v1(58.78,68.94) v1(58.78,66.4) v1(58.78,63.86) v1(58.78,61.32) v1(58.78,58.78) v1(58.78,56.24) v1(58.78,53.7) v1(58.78,51.16) v1(58.78,48.62) v1(58.78,46.08) v1(58.78,28.3) v1(58.78,20.68) v1(58.78,18.14) v1(58.78,7.98) v1(58.78,5.44) v1(59.58,38.3) v1(59.58,37.31) v1(61.32,74.02) v1(61.32,71.48) v1(61.32,68.94) v1(61.32,66.4) v1(61.32,63.86) v1(61.32,61.32) v1(61.32,58.78) v1(61.32,51.16) v1(61.32,48.62) v1(61.32,46.08) v1(61.32,30.84) v1(61.32,20.68) v1(61.32,18.14) v1(61.32,7.98) v1(61.32,5.44) v1(63.86,74.02) v1(63.86,71.48) v1(63.86,68.94) v1(63.86,66.4) v1(63.86,63.86) v1(63.86,48.62) v1(63.86,46.08) v1(63.86,41) v1(63.86,28.3) v1(63.86,25.76) v1(63.86,23.22) v1(63.86,18.14) v1(63.86,15.6) v1(63.86,7.98) v1(63.86,5.44) v1(66.4,74.02) v1(66.4,71.48) v1(66.4,68.94) v1(66.4,66.4) v1(66.4,63.86) v1(66.4,28.3) v1(66.4,25.76) v1(66.4,23.22) v1(68.42,40.27) v1(68.56,43.67) v1(68.94,74.02) v1(68.94,71.48) v1(68.94,68.94) v1(68.94,66.4) v1(68.94,63.86) v1(68.94,46.08) v1(68.94,30.84) v1(68.94,28.3) v1(68.94,25.76) v1(68.94,23.22) v1(71.48,74.02) v1(71.48,71.48) v1(71.48,68.94) v1(71.48,66.4) v1(71.48,63.86) v1(71.48,46.08) v1(71.48,43.54) v1(71.48,30.84) v1(71.48,28.3) v1(71.48,25.76) v1(71.48,23.22) v1(74.02,74.02) v1(74.02,71.48) v1(74.02,68.94) v1(74.02,66.4) v1(74.02,63.86) v1(74.02,51.16) v1(74.02,41) v1(74.02,30.84) v1(74.02,28.3) v1(74.02,25.76) v1(74.02,23.22) v1(76.56,74.02) v1(76.56,71.48) v1(76.56,68.94) v1(76.56,66.4) v1(76.56,63.86) v1(76.56,51.16) v1(76.56,46.08) v1(76.56,43.54) v1(76.56,30.84) v1(76.56,28.3) v1(76.56,25.76) v1(76.56,23.22) v1(76.56,18.14) v1(76.56,15.6) v1(76.56,13.06) v1(76.81,36.17) v1(78.84,63.86) v1(79.1,74.02) v1(79.1,71.48) v1(79.1,68.94) v1(79.1,66.4) v1(79.1,53.7) v1(79.1,51.16) v1(79.1,48.62) v1(79.1,46.08) v1(79.1,30.84) v1(79.1,28.3) v1(79.1,25.76) v1(79.1,23.22) v1(81.64,74.02) v1(81.64,71.48) v1(81.64,68.94) v1(81.64,66.4) v1(81.64,51.16) v1(81.64,48.62) v1(81.64,30.84) v1(81.64,28.3) v1(81.64,25.76) v1(81.64,23.22) v1(81.64,18.14) v1(81.64,15.6) v1(81.64,10.52) v1(81.89,41.25) v1(81.89,36.17) v1(84.18,74.02) v1(84.18,71.48) v1(84.18,68.94) v1(84.18,66.4) v1(84.18,63.86) v1(84.18,51.16) v1(84.18,48.62) v1(84.18,30.84) v1(84.18,28.3) v1(84.18,25.76) v1(84.18,23.22) v1(84.18,18.14) v1(84.18,15.6) v1(84.18,10.52) v1(84.18,5.44) v1(86.72,74.02) v1(86.72,71.48) v1(86.72,68.94) v1(86.72,66.4) v1(86.72,63.86) v1(86.72,61.32) v1(86.72,30.84) v1(86.72,28.3) v1(86.72,25.76) v1(86.72,23.22) v1(86.72,20.68) v1(86.72,18.14) v1(86.72,15.6) v1(86.72,10.52) v1(86.72,7.98) v1(86.72,5.44) v1(86.72,2.9) v1(86.97,41.25) v1(86.97,36.17) v1(89.26,74.02) v1(89.26,71.48) v1(89.26,68.94) v1(89.26,66.4) v1(89.26,63.86) v1(89.26,28.3) v1(89.26,25.76) v1(89.26,23.22) v1(89.26,20.68) v1(89.26,18.14) v1(89.26,15.6) v1(89.26,10.52) v1(89.26,7.98) v1(89.26,5.44) v1(89.26,2.9) v1(91.8,74.02) v1(91.8,71.48) v1(91.8,68.94) v1(91.8,66.4) v1(91.8,63.86) v1(91.8,30.84) v1(91.8,28.3) v1(91.8,25.76) v1(91.8,23.22) v1(91.8,20.68) v1(91.8,18.14) v1(91.8,15.6) v1(91.8,10.52) v1(91.8,5.44) v1(91.8,2.9) v1(92.05,36.17) v1(94.34,74.02) v1(94.34,71.48) v1(94.34,66.4) v1(94.34,56.24) v1(94.34,53.7) v1(94.34,51.16) v1(94.34,48.62) v1(94.34,46.08) v1(94.34,43.54) v1(94.34,41) v1(94.34,38.46) v1(94.34,30.84) v1(94.34,28.3) v1(94.34,25.76) v1(94.34,23.22) v1(94.34,18.14) v1(94.34,15.6) v1(94.34,10.52) v1(94.34,5.44) v1(94.34,2.9) v1(96.88,74.02) v1(96.88,56.24) v1(96.88,51.16) v1(96.88,48.62) v1(96.88,46.08) v1(96.88,41) v1(96.88,38.46) v1(96.88,35.92) v1(96.88,33.38) v1(96.88,30.84) v1(96.88,28.3) v1(96.88,25.76) v1(96.88,23.22) v1(96.88,15.6) v1(96.88,13.06) v1(96.88,7.98) v1(96.88,5.44) v1(96.88,2.9)
VBAT: length 90.2
  Top Layer w0.254: v1(63.08,36.77) 62.75,36.77 61.83,37.69 U1.19
  Top Layer w0.508: v1(63.08,28.9) 62.11,28.9 D2.2 ; 67.54,38.12 65.87,38.12 64.65,36.9 63.21,36.9 v1(63.08,36.77) ; 67.54,38.12 69.48,38.12 ; 67.54,38.12 67.54,39.24 C22.1 ; 69.48,38.12 70.57,38.12 v1(70.58,38.12) ; 69.48,38.12 69.56,38.2 R29.2 ; RSENS_VBAT1.2 90.15,59.5 89.96,59.5 89.41,58.95 89.41,47.6 86.45,44.65 ; v1(75.66,38.55) 81.75,44.64 ; 81.75,44.64 81.74,44.64 71.46,34.36 69.3,34.36 69.17,34.23 R14.2 ; 81.75,44.64 81.75,44.65 86.45,44.65 ; 81.75,44.64 86.45,44.64 86.45,44.65 ; 86.45,44.65 90.04,44.65 91.06,43.63
  Bottom Layer w0.508: v1(63.08,28.9) 64.23,30.04 64.23,31.82 63.08,32.96 v1(63.08,36.77) ; v1(70.58,38.12) 75.22,38.12 v1(75.66,38.55)
VBATS: length 17.2
  Top Layer w0.254: R30.2 70.84,39.95 v1(70.58,39.95) 70.31,39.95 R29.1 ; v1(63.85,33.47) 61.02,36.3 U1.16
  Bottom Layer w0.508: v1(63.85,33.47) 69.18,38.8 69.43,38.8 v1(70.58,39.95)
VBUS: length 56.4
  Top Layer w0.254: U1.31 57.51,40.77 56.94,41.34 v1(55.27,41.34) 54.45,42.17 54.45,42.81 C17.1 ; R1.2 52.16,36.25 v1(52.16,36.26)
  Top Layer w0.381: R4.2 49.12,39.06 48.61,39.56 41.78,39.56 36.96,44.39 31.33,44.39 29.74,45.99 29,45.99 28.54,45.53 28.54,43.48 28.67,43.36
  Top Layer w0.508: 34.64,35.82 35.46,36.64 v1(48.22,36.64)
  Bottom Layer w0.508: 55.21,41.34 55.21,39.31 v1(52.16,36.26) 51.78,36.64 v1(48.22,36.64)
(no net): length 1.8
  Top Layer w0.254: R34.1 R33.2
#CE: length 33
  Top Layer w0.254: U1.7 56.03,37.3 55.31,36.57 v1(55.31,35.6) ; v1(43.56,18.74) 38.77,13.94 38.77,13.57 STM32F103C8T6.40
  Bottom Layer w0.254: v1(55.31,35.6) 49.91,30.2 49.91,24.33 46.86,21.28 46.1,21.28 v1(43.56,18.74)
ADC: length 72.2
  Top Layer w0.254: 31.23,7.44 30.4,6.62 30.4,6.52 v1(29.28,5.4) ; v1(62.1,19.12) 64.33,21.35 85.34,21.35 ; 85.34,21.35 R35.1 ; 85.34,21.35 R34.2
  Bottom Layer w0.254: v1(29.28,5.4) 29.28,3.81 31.62,1.47 45.72,1.47 62.1,17.85 v1(62.1,19.12)
ADIN: length 12.5
  Top Layer w0.254: U1.13 58.71,34.03 59.53,33.22 63.07,33.22 R19.1 R20.2 66.14,30.22 C26.2
BOOT0: length 2.3
  Top Layer w0.254: 35.88,13.22 35.88,13.51 STM32F103C8T6.44
  Bottom Layer w0.254: R3.2 35.75,12.97 v1(35.88,13.09)
BOOT1: length 2.3
  Top Layer w0.254: v1(32.57,8.01) 32.5,8.01 STM32F103C8T6.20
  Bottom Layer w0.254: v1(32.57,8.01) R2#2.1
BT1: length 2.3
  Top Layer w0.254: C18.1 57.91,41.24 U1.30
BT2: length 4.2
  Top Layer w0.254: U1.20 62.01,38.09 62.58,37.53 63.28,37.53 C19.2
FB: length 10.8
  Top Layer w0.254: U1.14 59.11,35.28 59.4,34.99 v1(59.4,34.61) ; v1(58,34.23) 54.7,34.23 53.94,33.47 R2.2 R1.1
  Bottom Layer w0.254: v1(58,34.23) 59.02,34.23 v1(59.4,34.61)
GPO: length 90.6
  Top Layer w0.254: v1(52.92,38.3) 53.43,38.3 54.43,39.3 U1.2
  Top Layer w0.508: 7.97,40.2 9.36,41.6
  Top Layer w0.762: R25.1 17.26,46.41 16.47,45.63 16.47,42.49 15.59,41.6 9.36,41.6 ; v1(46.83,30.17) 46.83,30.04 39.16,22.37 15.67,22.37 7.97,30.08 7.97,40.2
  Bottom Layer w0.508: v1(52.92,38.3) 48.35,38.3 46.83,36.77 v1(46.83,30.17)
HD1: length 20.5
  Top Layer w0.254: v1(58,42.36) 58.31,42.05 U1.29
  Top Layer w0.508: R6.1 46.2,52.38 47.46,51.12 47.46,48.45 48.61,47.31 53.81,47.31 v1(54.19,46.93)
  Bottom Layer w0.508: v1(58,42.36) 57.62,42.36 54.19,45.79 v1(54.19,46.93)
HD2: length 35.8
  Top Layer w0.254: U1.21 62.6,38.5 v1(62.91,38.19)
  Top Layer w0.508: v1(65.24,39.44) 66.39,40.58 66.39,46.8 67.4,47.82 72.35,47.82 72.99,48.45 72.99,54.81 72.48,55.31 69.81,55.31 69.05,56.08 69.05,57.6 68.41,58.24 R8.2
  Bottom Layer w0.508: v1(62.91,38.19) 64,38.19 v1(65.24,39.44)
INT: length 41.5
  Top Layer w0.254: 38.65,12.04 39.76,13.15 v1(40.64,13.15) ; v2(58.13,35.25) 57.91,35.47 U1.11 ; v1(56.13,21.28) 56.13,20
  Bottom Layer w0.254: v2(58.13,35.25) 59.82,35.25 60.83,34.23 60.83,33.98 56.13,29.28 v1(56.13,21.28) ; v1(40.64,13.15) 45.47,13.15 51.31,18.99 55.88,18.99 56.13,19.25 56.13,19.88
  vias: v1(56.13,19.92)
LD1: length 38.5
  Top Layer w0.254: U1.27 59.11,40.93 v1(59.32,41.14)
  Top Layer w0.508: v1(59.4,44.9) 59.02,45.28 45.05,45.28 42.89,47.44 42.89,54.7 42.26,55.34 39.97,55.34 39.21,56.1 39.21,57.73 38.7,58.24 R7.1
  Bottom Layer w0.508: v1(59.32,41.14) 59.4,41.22 v1(59.4,44.9)
LD2: length 19.4
  Top Layer w0.254: U1.23 60.99,39.3 61.56,39.86 v1(61.56,40.07)
  Top Layer w0.508: R9.2 74.78,44.64 71.86,41.72 v1(67.78,41.72)
  Bottom Layer w0.508: v1(67.78,41.72) 63.21,41.72 v1(61.56,40.07)
NRST: length 20.7
  Top Layer w0.254: STM32F103C8T6.7 30.14,14.19 27.78,14.19 27.52,13.93 27.52,13.38 27.52,13.38 27.11,12.97 27.11,8.62 SW1.2 SW1.1 21.69,8.56 22.03,8.9 v1(22.41,8.9)
  Bottom Layer w0.254: v1(22.41,8.9) 23.05,8.9 23.18,8.78 C9#2.2 24.77,7.32 R4#2.1
OSC32_IN: length 6.4
  Top Layer w0.254: STM32F103C8T6.3 32.29,14.91 29.78,17.41 X1.2 C10#2.1
OSC32_OUT: length 5.6
  Top Layer w0.254: C11#2.1 27.05,15.89 X1.1 30.54,15.89 31.91,14.52 STM32F103C8T6.4
OSC_IN: length 10.6
  Top Layer w0.254: STM32F103C8T6.5 30.74,15 25.16,15 8M.1 23.68,14.11 C12#2.1
OSC_OUT: length 10.2
  Top Layer w0.254: STM32F103C8T6.6 30.44,14.59 27.34,14.59 27.11,14.36 27.11,13.6 26.71,13.2 26.71,12.18 26.14,11.61 8M.3 25.68,9.81 C13#2.2
PC13: length 16.4
  Top Layer w0.254: LED2.1 42.61,4.29 42.61,7 39.19,10.42 37.41,10.42 32.64,15.19 STM32F103C8T6.2
PGATE: length 46.7
  Top Layer w0.508: R27.1 49.28,35.76 37.97,24.45 17.49,24.45 16.09,25.85 16.09,31.3 R26.1
PSTOP: length 33.2
  Top Layer w0.254: STM32F103C8T6.39 42.29,16.39 v1(42.29,16.58) ; U1.8 55.97,36.36 v1(55.97,36.01)
  Bottom Layer w0.254: v1(42.29,16.58) 44.58,18.87 46.48,18.87 50.8,23.18 50.8,30.17 55.97,35.34 v1(55.97,36.01)
PWRIN: length 191.2
  Top Layer w0.254: U1.6 55.63,37.69 54.7,36.77 v1(54.7,36.39)
  Top Layer w0.508: v1(47.97,28.64) 47.97,26.78
  Top Layer w0.762: Q5.2 11.89,45.61 6.95,40.67 6.95,28.43 14.05,21.33 17.83,21.33 ; 17.83,21.33 11.3,14.8 11.3,5.02 15.65,0.68 64.9,0.68 66.46,2.24 ; 17.83,21.33 39.77,21.33 45.18,26.74 D3.2
  Top Layer w1.27: C6#2.2 66.34,13.29 66.08,13.03 66.08,2.62 66.96,1.75 100K.2
  Top Layer w5.588: 12.03,45.72 Q5.2
  Bottom Layer w0.508: v1(54.7,36.39) 53.31,36.39 51.4,34.48 v1(51.02,34.48) 49.37,34.48 47.97,33.09 v1(47.97,28.64)
PWROUT: length 100.9
  Top Layer w0.254: U1.5 55.27,38.09 53.94,36.76 v1(53.94,35.12)
  Top Layer w0.508: D1.2 49.24,24.37 v1(49.24,24.83) ; Q6.2 v1(12.14,28.36) 17.07,23.44 38.57,23.44 47.84,32.71 v1(49.24,32.71)
  Bottom Layer w0.508: H2.4 1.95,24.03 2.99,22.98 v1(6.76,22.98) ; v1(53.94,35.12) 52.16,33.34 49.88,33.34 v1(49.24,32.71) v1(49.24,24.83) ; v1(6.76,22.98) 6.76,12.04 NOREF#3.1 ; v1(6.76,22.98) v1(12.14,28.36)
RX: length 70.4
  Top Layer w0.254: v1(17.14,3.5) 27.43,3.5 28.57,4.64 28.57,9.04 STM32F103C8T6.13
  Bottom Layer w0.254: H2.23 7.75,49.69 15.37,42.07 15.37,5.28 v1(17.14,3.5)
SCL: length 35.1
  Top Layer w0.254: v1(50.55,21.15) 50.55,20 ; R23.2 49.86,19.87 49.85,19.88 43.66,19.88 STM32F103C8T6.42 ; U1.9 56.89,36.3 56.61,36.01 v1(56.61,35.37)
  Bottom Layer w0.254: v1(56.61,35.37) 56.61,34.96 52.32,30.68 52.32,22.93 v1(50.55,21.15)
SCL2: length 77.9
  Top Layer w0.254: STM32F103C8T6.21 31.93,6.73 30.73,5.53 30.61,5.53 v1(26.8,1.72)
  Bottom Layer w0.254: H2.28 1.95,54.64 3.06,53.54 10.8,53.54 16.38,47.95 16.38,7.31 21.97,1.72 v1(26.8,1.72)
SDA: length 37.5
  Top Layer w0.254: v1(53.09,21.15) R22.2 ; U1.10 57.51,35.14 v1(57.24,34.87) ; v1(49.28,20.52) 43.59,20.52 STM32F103C8T6.43
  Bottom Layer w0.254: v1(57.24,34.87) 53.09,30.71 v1(53.09,21.15) 52.45,20.52 v1(49.28,20.52)
SDA2: length 75.3
  Top Layer w0.254: STM32F103C8T6.22 31.46,5.56 31.46,5.5 v1(28.32,2.36)
  Bottom Layer w0.254: H2.27 11.56,54.77 17.65,48.67 17.65,7.56 22.86,2.36 v1(28.32,2.36)
SNS1N: length 6.7
  Top Layer w0.254: U1.32 57.1,40.29 53.41,40.29 C7.2 52.73,40.58 51.39,40.58 R5#2.1
SNS1P: length 6.2
  Top Layer w0.254: U1.1 56.33,39.88 53.43,39.88 C7.1 52.73,39.56 51.39,39.56 R4.1
SNS2N: length 7.1
  Top Layer w0.254: U1.17 61.37,36.89 62.75,35.51 63.13,35.51 C16.1 64.55,34.99 65.38,34.99 R14.1
SNS2P: length 6.7
  Top Layer w0.254: R15.1 65.38,35.5 64.55,35.5 C16.2 62.94,35.95 61.59,37.3 U1.18
SW1: length 21.7
  Top Layer w0.254: 56.99,43.31 57.05,43.38 58.26,43.38 58.71,42.92 U1.28
  Top Layer w0.508: C18.2 v1(56.99,44.39) ; 48.35,54.04 48.35,48.84 48.99,48.2 54.19,48.2 v1(55.08,47.31)
  Bottom Layer w0.508: v1(56.99,44.39) 55.08,46.3 v1(55.08,47.31)
SW2: length 14.7
  Top Layer w0.254: C19.1 63.24,38.89 U1.22
  Top Layer w0.508: C19.1 65.37,41.03 65.37,48.84
  Top Layer w0.762: R11.1 64.33,56.84
SWCLK: length 5
  Top Layer w0.254: STM32F103C8T6.37 43.67,11.69 43.88,11.9
SWDIO: length 9.8
  Top Layer w0.254: STM32F103C8T6.34 37.4,9.76 v1(37.4,9.79) ; H1.3 40.82,9.36 39.37,10.81 39.3,10.81 ; 39.19,10.82 38.4,10.82 38.04,11.19 v1(37.53,11.19)
  Bottom Layer w0.254: v1(37.53,11.19) 37.4,11.06 v1(37.4,9.79)
TX: length 67.9
  Top Layer w0.254: v1(14.22,14.42) 14.22,5.15 14.99,4.39 27.05,4.39 27.75,5.09 27.75,9.28 29.59,11.12 29.59,11.2 STM32F103C8T6.12
  Bottom Layer w0.254: v1(14.22,14.42) 14.22,39.57 9.18,44.61 H2.19
$1N171: length 6.6
  Top Layer w0.305: MP2236.6 79.64,7.47 v1(79.67,7.44)
  Bottom Layer w0.305: v1(75.99,9.48) 79.29,9.48 79.67,9.09 v1(79.67,7.44)
$1N1061: length 3.6
  Top Layer w0.381: 10R.1 78.99,5.24 MP2236.5
$1N1238: length 2.3
  Top Layer w1.27: 0.1UF.2 74.5,5.03 10R.2
$1N4997: length 1.7
  Top Layer w0.254: LED2.2 44.42,2.47 R5#3.2
$1N5550: length 2.2
  Top Layer w0.508: Q1.1 46.07,49.36 R6.2
$1N5553: length 2.2
  Top Layer w0.508: Q2.1 36.41,61.27 R7.2
$1N5556: length 2.2
  Top Layer w0.508: R8.1 66.39,61.27 Q3.1
$1N5559: length 2.6
  Top Layer w0.508: R9.1 76.28,49.23 76.16,49.36 Q4.1
$1N5746: length 2.1
  Top Layer w0.762: C8.1 R10.2
$1N5749: length 2.1
  Top Layer w0.762: R11.2 C9.1
$1N7696: length 4.2
  Top Layer w0.254: 59.78,42.17 59.91,42.04 U1.25
  Top Layer w0.508: C20.1 61.76,42.17 R16.1
$1N8787: length 1.8
  Bottom Layer w0.254: R2#2.2 34,9 U1#2.2
$1N8790: length 1.8
  Bottom Layer w0.254: U1#2.5 33.34,12.06 R3.1
$1N8909: length 2.9
  Top Layer w0.254: C23.2 52.74,29.97 R17.1
$1N8945: length 17.1
  Top Layer w0.254: U1.15 59.51,35.82 60.04,35.29 60.04,34.1 v1(59.91,33.98) ; v1(58.13,33.34) 57.88,33.6 55.72,33.6 55.21,33.09 55.21,30.94 R17.2 54.19,29.91 53.05,28.77 50.7,28.77 C24.2
  Bottom Layer w0.254: v1(58.13,33.34) 59.27,33.34 v1(59.91,33.98)
$1N10523: length 10.6
  Top Layer w0.254: U2.2 62.52,32.14 R19.2 R18.1 ; U2.2 U2.1 ; U2.2 60.28,32.18 55.97,32.18
$1N10819: length 8.4
  Top Layer w0.254: R27.2 50.27,38.17 51.97,38.17 C27.2 53.55,37.28 54.76,38.5 U1.4
$1N11094: length 6
  Top Layer w0.508: 21.3,43.32 18.74,43.32 18.73,43.34 ; 21.3,43.32 R25.2 ; 21.3,43.32 R24.1
$1N11328: length 2.7
  Top Layer w0.508: 18.73,35.13 19.51,35.13 R26.2
$1N29448: length 26
  Top Layer w0.381: 28.67,49.49 28.67,47.29 29.18,46.78 30.09,46.78 31.72,45.15 37.18,45.15 41.9,40.43 48.73,40.43 49.38,41.07 R5#2.2
$1N29969: length 37.4
  Top Layer w0.508: RSENS_VBAT1.1 86.23,60.14 86.74,59.63 86.74,48.84 84.01,46.11 80.82,46.11 70.95,36.23 67.68,36.23 R15.2
$1N46207: length 7.8
  Top Layer w0.508: R32.1 64.29,13.15 64.29,12 63.16,10.86 R31.2 60.26,10.86 U6.1
$1N53072: length 26.5
  Top Layer w1.016: U6.3 60.1,15.76 C48.1 58.34,24.81 55.48,24.81 ; 55.48,24.81 C47.1 D1.1 D3.1 D2.1 55.48,26.67 55.48,24.81

## Copper pours and planes (outline as drawn; the poured copper is in the pictures)
GND on Top Layer: 73.53,12.91 75.53,12.91 75.53,12.01 73.53,12.01
GND on Top Layer: 73.6,12.38 75.51,12.38 75.51,10.71 73.6,10.71
GND on Top Layer: 80.69,11.89 85.39,11.89 85.39,5.16 80.69,5.16
GND on Top Layer: -3.3,79.44 103.38,79.44 103.38,-7.68 -3.3,-7.68
GND on Top Layer: 73.47,12.29 78.83,12.81 78.83,20.14 73.47,20.14
GND on Top Layer: 80.69,11.89 83.74,11.89 83.74,10.37 80.69,10.37
GND on Bottom Layer: -5.21,78.81 103,78.81 103,-5.65 -5.21,-5.65
VBAT on Top Layer: 81.41,45.28 86.36,45.28 91.29,50.21 91.29,52.26 93.09,52.26 93.09,34.87 71.63,34.87 71.37,34.61 71.37,35.25
VBAT on Top Layer: 89.18,61.77 99.6,61.77 99.6,40.2 89.18,40.2
VBAT on Top Layer: 68.96,35.5 94.36,35.5 94.36,33.6 68.96,33.6
VBUS on Top Layer: 32.6,41.6 34.36,41.6 34.36,39.88 32.6,39.88
VBUS on Top Layer: 19.14,54.68 35.82,54.68 35.82,35.3 19.14,35.3
PWRIN on Top Layer: 65.45,19 68.37,19 68.37,12.65 65.45,12.65
PWRIN on Top Layer: 14.49,21.33 20.83,21.33 20.83,-0.31 14.49,-0.31
PWRIN on Top Layer: 6.86,49.47 15.88,49.47 15.88,-0.31 6.86,-0.31
PWRIN on Top Layer: 20.45,2.74 68.96,2.74 68.96,0.32 20.45,0.32
PWRIN on Top Layer: 67.48,19.02 73.07,19.02 73.07,9.22 67.48,9.22
PWRIN on Top Layer: 79.86,2.55 84.31,2.55 84.31,0.9 79.86,0.9
PWROUT on Top Layer: 9.02,34.74 14.99,34.74 15.11,34.87 15.11,24.2 9.14,30.17 9.14,34.61
PWROUT on Top Layer: 14.61,27.5 14.61,24.72 16.4,22.93 39.12,22.93 48.36,32.17 48.36,33.94 44.87,33.94 44.7,34.11 36.83,26.23 18.46,26.23 17.19,27.5
SW1 on Top Layer: 40.35,62.04 52.16,62.04 52.16,53.28 40.35,53.28
SW2 on Top Layer: 60.54,57.47 72.23,57.47 72.23,48.58 60.54,48.58
$1N171 on Top Layer: 73.96,9.86 77.77,9.86 77.77,8.48 73.96,8.48
$1N800 on Top Layer: 80.03,9.86 83.97,9.86 83.97,7.82 80.03,7.82
$1N1269 on Top Layer: 67.59,12.19 79.9,12.19 79.9,2.92 67.59,2.92
$1N1940 on Top Layer: 79.93,9.35 81.96,9.35 81.96,3 79.93,3
$1N1940 on Top Layer: 79.93,4.52 84.37,4.52 84.37,2.87 79.93,2.87
$1N29448 on Top Layer: 26.89,54.68 42.13,54.68 42.13,48.58 26.89,48.58
$1N29969 on Top Layer: 70.32,62.04 85.31,62.04 85.31,55.95 70.32,55.95

Small or netless copper shapes (teardrops, artwork), in the pictures only: 2 on Top Layer

## Text on the board
Top Silkscreen Layer: 22UF | JLCJLCJLCJLC | GND | CLK | 3V3 | DIO | PWROUT
